# Altium schematic sheet ElectrodeBreakout.SchDoc
size A
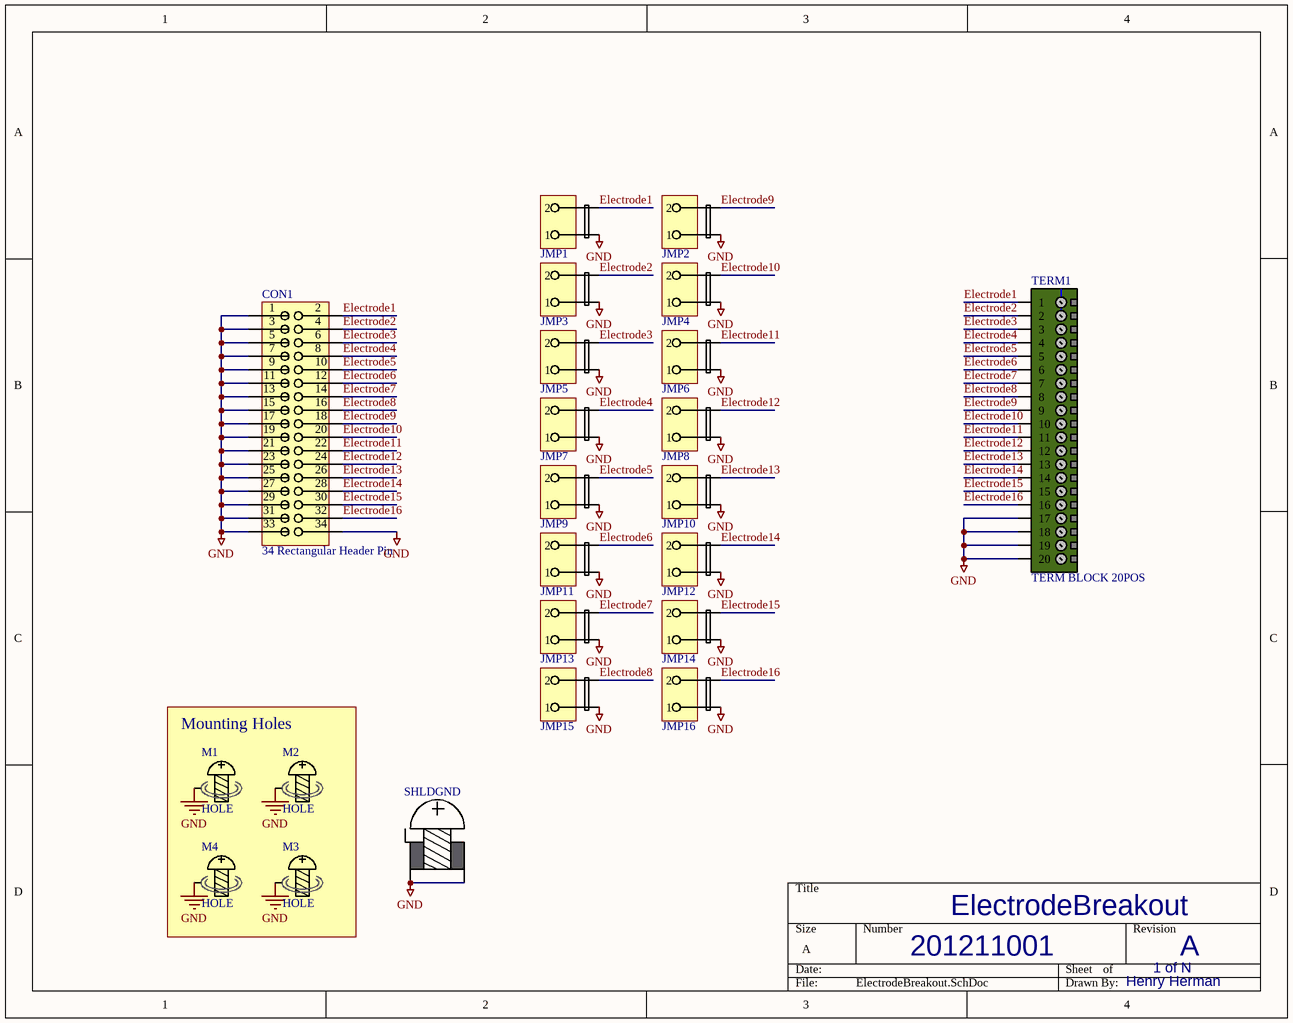
[diagram p0: ElectrodeBreakout.SchDoc]

## Parts
CON1  34 Rectangular Header Pin  [34Pin-Rectangular Header-SurfaceMount-100milSpacing]
JMP1  JMPR-2PIN-THRU  [M02]  (value not drawn)
JMP2  JMPR-2PIN-THRU  [M02]  (value not drawn)
JMP3  JMPR-2PIN-THRU  [M02]  (value not drawn)
JMP4  JMPR-2PIN-THRU  [M02]  (value not drawn)
JMP5  JMPR-2PIN-THRU  [M02]  (value not drawn)
JMP6  JMPR-2PIN-THRU  [M02]  (value not drawn)
JMP7  JMPR-2PIN-THRU  [M02]  (value not drawn)
JMP8  JMPR-2PIN-THRU  [M02]  (value not drawn)
JMP9  JMPR-2PIN-THRU  [M02]  (value not drawn)
JMP10  JMPR-2PIN-THRU  [M02]  (value not drawn)
JMP11  JMPR-2PIN-THRU  [M02]  (value not drawn)
JMP12  JMPR-2PIN-THRU  [M02]  (value not drawn)
JMP13  JMPR-2PIN-THRU  [M02]  (value not drawn)
JMP14  JMPR-2PIN-THRU  [M02]  (value not drawn)
JMP15  JMPR-2PIN-THRU  [M02]  (value not drawn)
JMP16  JMPR-2PIN-THRU  [M02]  (value not drawn)
M1  HOLE  [MOUNTING_HOLE-125mil - Thin]
M2  HOLE  [MOUNTING_HOLE-125mil - Thin]
M3  HOLE  [MOUNTING_HOLE-125mil - Thin]
M4  HOLE  [MOUNTING_HOLE-125mil - Thin]
SHLDGND  SCREW TERM (10-32)  [LOW-PROFILE-SCREWTERMINAL]  (value not drawn)
TERM1  TERM BLOCK 20POS  [EuroStyleConnector-20Pin-3.5mm]

## Blocks framed on the sheet
Mounting Holes: M1-M4

## Nets
GND: CON1.1 CON1.3 CON1.5 CON1.7 CON1.9 CON1.11 CON1.13 CON1.15 CON1.17 CON1.19 CON1.21 CON1.23 CON1.25 CON1.27 CON1.29 CON1.31 CON1.33 CON1.34 JMP1.1 JMP2.1 JMP3.1 JMP4.1 JMP5.1 JMP6.1 JMP7.1 JMP8.1 JMP9.1 JMP10.1 JMP11.1 JMP12.1 JMP13.1 JMP14.1 JMP15.1 JMP16.1 M1.0(PAD) M2.0(PAD) M3.0(PAD) M4.0(PAD) SHLDGND.1 TERM1.17 TERM1.18 TERM1.19 TERM1.20
Electrode1: CON1.2 JMP1.2 TERM1.1
Electrode2: CON1.4 JMP3.2 TERM1.2
Electrode3: CON1.6 JMP5.2 TERM1.3
Electrode4: CON1.8 JMP7.2 TERM1.4
Electrode5: CON1.10 JMP9.2 TERM1.5
Electrode6: CON1.12 JMP11.2 TERM1.6
Electrode7: CON1.14 JMP13.2 TERM1.7
Electrode8: CON1.16 JMP15.2 TERM1.8
Electrode9: CON1.18 JMP2.2 TERM1.9
Electrode10: CON1.20 JMP4.2 TERM1.10
Electrode11: CON1.22 JMP6.2 TERM1.11
Electrode12: CON1.24 JMP8.2 TERM1.12
Electrode13: CON1.26 JMP10.2 TERM1.13
Electrode14: CON1.28 JMP12.2 TERM1.14
Electrode15: CON1.30 JMP14.2 TERM1.15
Electrode16: CON1.32 JMP16.2 TERM1.16

## Notes on the sheet
- 201211001
- ElectrodeBreakout
- 1 of N
- A
- Henry Herman

## Library data of the parts
CON1 = 34pinHeader
M1-M4 = MountingHole
SHLDGND = ScrewTerminal-PCB-ThruHole
TERM1 = EuroStyleTerminalBlock_20Pin: Manufacturer Number: 1757242; Digikey Number: 277-1106-ND